# Altium schematic sheet Choin_cpu1_0.SchDoc
size A4; LotOfPieces: 1
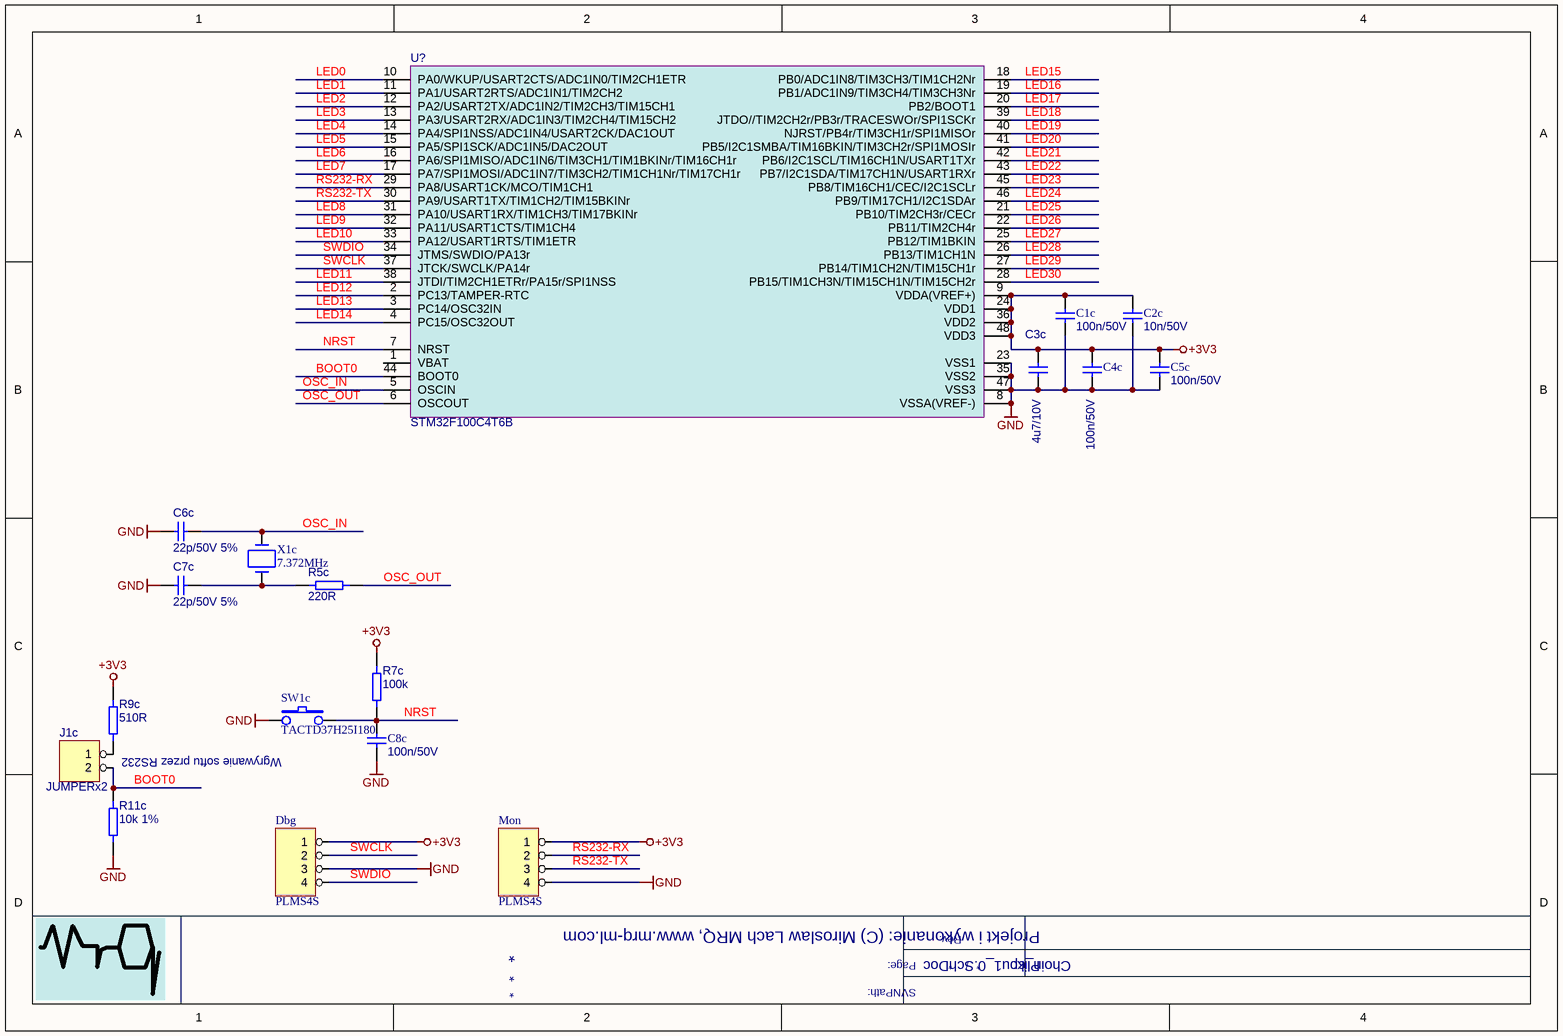
[diagram p0: Choin_cpu1_0.SchDoc]

## Parts
C1c  OtherParams: 100n/50V  [0805]  (hidden comment: CL21B104KBCNNNC)
C2c  OtherParams: 10n/50V  [0805]  (hidden comment: CL21B103KBANNNC)
C3c  OtherParams: 4u7/10V  [1206-IPC]  (hidden comment: CL31B475KPHNNNE)
C4c  OtherParams: 100n/50V  [0805]  (hidden comment: CL21B104KBCNNNC)
C5c  OtherParams: 100n/50V  [0805]  (hidden comment: CL21B104KBCNNNC)
C6c  OtherParams: 22p/50V 5%  [0805]  (hidden comment: CL21C220JBANNNC)
C7c  OtherParams: 22p/50V 5%  [0805]  (hidden comment: CL21C220JBANNNC)
C8c  OtherParams: 100n/50V  [0805]  (hidden comment: CL21B104KBCNNNC)
Dbg  PLMS4S  [PLMS4S]
J1c  JUMPERx2  [2SIP100]
Mon  PLMS4S  [PLMS4S]
R5c  OtherParams: 220R  [0805]  (hidden comment: 0805WAJ 220R T5E)
R7c  OtherParams: 100k  [0805]  (hidden comment: 0805WAJ 100K T5E)
R9c  OtherParams: 510R  [0805]  (hidden comment: 0805WAJ 510R T5E)
R11c  OtherParams: 10k 1%  [0805]  (hidden comment: 0805WAF10KT5E)
SW1c  TACTD37H25I180  [TACTD37H25I180]
U?  STM32F100C4T6B  [MS-026ABC]
X1c  7.372MHz  [HC49/4HSMX]

## Nets
+3V3: C1c.1 C2c.1 C3c.1 C4c.1 C5c.1 Dbg.1 Mon.1 R7c.1 R9c.1 U?.9(VDDA(VREF+)) U?.24(VDD1) U?.36(VDD2) U?.48(VDD3)
GND: C1c.2 C2c.2 C3c.2 C4c.2 C5c.2 C6c.1 C7c.1 C8c.2 Dbg.3 Mon.4 R11c.1 SW1c.1 U?.8(VSSA(VREF-)) U?.23(VSS1) U?.35(VSS2) U?.47(VSS3)
BOOT0: J1c.2 R11c.2 U?.44(BOOT0)
LED0: U?.10(PA0/WKUP/USART2CTS/ADC1IN0/TIM2CH1ETR)
LED1: U?.11(PA1/USART2RTS/ADC1IN1/TIM2CH2)
LED2: U?.12(PA2/USART2TX/ADC1IN2/TIM2CH3/TIM15CH1)
LED3: U?.13(PA3/USART2RX/ADC1IN3/TIM2CH4/TIM15CH2)
LED4: U?.14(PA4/SPI1NSS/ADC1IN4/USART2CK/DAC1OUT)
LED5: U?.15(PA5/SPI1SCK/ADC1IN5/DAC2OUT)
LED6: U?.16(PA6/SPI1MISO/ADC1IN6/TIM3CH1/TIM1BKINr/TIM16CH1r)
LED7: U?.17(PA7/SPI1MOSI/ADC1IN7/TIM3CH2/TIM1CH1Nr/TIM17CH1r)
LED8: U?.31(PA10/USART1RX/TIM1CH3/TIM17BKINr)
LED9: U?.32(PA11/USART1CTS/TIM1CH4)
LED10: U?.33(PA12/USART1RTS/TIM1ETR)
LED11: U?.38(JTDI/TIM2CH1ETRr/PA15r/SPI1NSS)
LED12: U?.2(PC13/TAMPER-RTC)
LED13: U?.3(PC14/OSC32IN)
LED14: U?.4(PC15/OSC32OUT)
LED15: U?.18(PB0/ADC1IN8/TIM3CH3/TIM1CH2Nr)
LED16: U?.19(PB1/ADC1IN9/TIM3CH4/TIM3CH3Nr)
LED17: U?.20(PB2/BOOT1)
LED18: U?.39(JTDO//TIM2CH2r/PB3r/TRACESWOr/SPI1SCKr)
LED19: U?.40(NJRST/PB4r/TIM3CH1r/SPI1MISOr)
LED20: U?.41(PB5/I2C1SMBA/TIM16BKIN/TIM3CH2r/SPI1MOSIr)
LED21: U?.42(PB6/I2C1SCL/TIM16CH1N/USART1TXr)
LED22: U?.43(PB7/I2C1SDA/TIM17CH1N/USART1RXr)
LED23: U?.45(PB8/TIM16CH1/CEC/I2C1SCLr)
LED24: U?.46(PB9/TIM17CH1/I2C1SDAr)
LED25: U?.21(PB10/TIM2CH3r/CECr)
LED26: U?.22(PB11/TIM2CH4r)
LED27: U?.25(PB12/TIM1BKIN)
LED28: U?.26(PB13/TIM1CH1N)
LED29: U?.27(PB14/TIM1CH2N/TIM15CH1r)
LED30: U?.28(PB15/TIM1CH3N/TIM15CH1N/TIM15CH2r)
NRST: C8c.1 R7c.2 SW1c.2 U?.7(NRST)
OSC_IN: C6c.2 U?.5(OSCIN) X1c.1
OSC_OUT: R5c.2 U?.6(OSCOUT)
RS232-RX: Mon.2 U?.29(PA8/USART1CK/MCO/TIM1CH1)
RS232-TX: Mon.3 U?.30(PA9/USART1TX/TIM1CH2/TIM15BKINr)
SWCLK: Dbg.2 U?.37(JTCK/SWCLK/PA14r)
SWDIO: Dbg.4 U?.34(JTMS/SWDIO/PA13r)
NetC7c_2: C7c.2 R5c.1 X1c.2
NetJ1c_1: J1c.1 R9c.2

Not connected (* = marked no-connect by the designer): U? 1(VBAT)

## Notes on the sheet
- Wgrywanie softu przez RS232
- Projekt i wykonanie: (C) Miroslaw Lach MRQ, www.mrq-ml.com
- SVNPath:
- Page:
- Rev.
- /
- Plik:

## Library data of the parts
C1c = CL21B104KBCNNNC[[/\]]0805[[/\]]50V[[/\]]10%[[/\]]100n/50V: MaxVoltage: 50V; Tolerance: 10%; Descript: capacitor 100nF/50V, 0805, X7R, 10%; Currency5: PLN; Amount5: 100+; Value: CL21B104KBCNNNC; Price1: 0,019; Dimensions: 0805; ComponentLink1Description: Datasheet; ComponentLink1URL: http://www.mrq-ml.com/Parts/Capacitors/mlcc_samsung.pdf; Supplier5: tme.pl; Reference5: CL21B104KBCNNNC; Manufacturer5: Samsung; Typ5: CL21B104KBCNNNC; Price5: 0,025; DateOfPrice5: 2013-01-03
C2c = CL21B103KBANNNC[[/\]]0805[[/\]]50V[[/\]]10%[[/\]]10n/50V: Manufacturer1: Samsung; MaxVoltage: 50V; Tolerance: 10%; Tmin: -55; Tmax: +125; Descript: capacitor 10nF/50V, 0805, X7R, 10%; Currency1: PLZ; Amount1: 12000+; Currency5: PLN; Amount5: 100+; Value: CL21B103KBANNNC; Supplier1: tme.pl; Reference1: CL21B103KBANNNC; Price1: 0,013; Typ1: CL21B103KBANNNC; Dimensions: 0805; ComponentLink1Description: Datasheet; ComponentLink1URL: http://www.mrq-ml.com/Parts/Capacitors/mlcc_samsung.pdf; DateOfPrice1: 2010-01-31; Supplier5: tme.pl; Reference5: CL21B103KBANNNC; Manufacturer5: Samsung; Typ5: CL21B103KBANNNC; Price5: 0,029; DateOfPrice5: 2012-09-19
C3c = CL31B475KPHNNNE[[/\]]1206[[/\]]10V[[/\]]10%[[/\]]4u7/10V: Manufacturer1: Samsung; MaxVoltage: 10V; Tolerance: 10%; Tmin: -55; Tmax: +125; Descript: capacitor 4.7uF, 10V, X7R, 10%, 1206; Currency1: PLN; Amount1: 12000+; Amount5: 100+; Value: CL31B475KPHNNNE; Supplier1: tme.pl; Reference1: CL31B475KPHNNNE; Typ1: CL31B475KPHNNNE; Dimensions: 1206; ComponentLink1Description: Datasheet; ComponentLink1URL: http://www.mrq-ml.com/Parts/Capacitors/mlcc_samsung.pdf; DateOfPrice1: 2010-09-07; Supplier5: tme.pl; Reference5: CL31B475KPHNNNE; Manufacturer5: Samsung; Typ5: CL31B475KPHNNNE; Price5: 0,179; Currency5: PLN; DateOfPrice5: 2012-11-24; Price1: 0,179
C4c C5c C8c = CL21B104KBCNNNC[[/\]]0805[[/\]]50V[[/\]]10%[[/\]]100n/50V: Manufacturer1: Samsung; MaxVoltage: 50V; Tolerance: 10%; Tmin: -55; Tmax: +125; Descript: capacitor 100nF/50V, 0805, X7R, 10%; Currency1: PLZ; Amount1: 12000+; Currency5: PLN; Amount5: 100+; Value: CL21B104KBCNNNC; Supplier1: tme.pl; Reference1: CL21B104KBCNNNC; Price1: 0,012; Typ1: CL21B104KBCNNNC; Dimensions: 0805; ComponentLink1Description: Datasheet; ComponentLink1URL: http://www.mrq-ml.com/Parts/Capacitors/mlcc_samsung.pdf; DateOfPrice1: 2010-05-06; Supplier5: tme.pl; Reference5: CL21B104KBCNNNC; Manufacturer5: Samsung; Typ5: CL21B104KBCNNNC; Price5: 0,025; DateOfPrice5: 2012-09-19
C6c C7c = CL21C220JBANNNC[[/\]]0805[[/\]]50V[[/\]]5%[[/\]]22p/50V 5%: Manufacturer1: Samsung; Amount2: 4000+; MaxVoltage: 50V; Tolerance: 5%; Tmin: -55; Tmax: +125; Descript: capacitor 22pF, 50V, COG 5%; Currency1: PLZ; Amount1: 12000+; Currency5: PLN; Amount5: 100+; Value: CL21C220JBANNNC; Supplier1: tme.pl; Reference1: CL21C220JBANNNC; Price1: 0,018; Price2: 0,012; Reference2: CL21C220JBANNNC; Supplier2: tme.pl; Typ1: CL21C220JBANNNC; Manufacturer2: Samsung; Dimensions: 0805; ComponentLink1Description: Datasheet; ComponentLink1URL: http://www.mrq-ml.com/Parts/Capacitors/mlcc_samsung.pdf; DateOfPrice1: 2010-04-07; Typ2: CL21C220JBANNNC; Currency2: PLZ; DateOfPrice2: 2009-08-16; Supplier5: tme.pl; Reference5: CL21C220JBANNNC; Manufacturer5: Samsung; Typ5: CL21C220JBANNNC; Price5: 0,029; DateOfPrice5: 2012-09-19
Dbg Mon = PLMS4S[[/\]]4x2mm: Descript: connector 2.00mm pitch, 4 poles, one row; Reference5: PLMS40S-LF; Currency5: PLN; Amount5: 1+; Value: PLMS4S; Dimensions: 4x2mm; ComponentLink1Description: Datasheet; ComponentLink1URL: http://www.mrq-ml.com/Parts/Connectors/plms40s-lf.pdf; Supplier5: maritex.com.pl; Price5: 0,085; DateOfPrice5: 2012-11-24; Price1: 0,0850
J1c = JUMPERx2[[/\]]2.54mm: Descript: pin header 2 pin, 1/40 of PLD80S; Reference1: PLD80S-2; Currency1: PLN; Amount1: 80000+; Currency2: PLZ; Amount2: 40000+; Amount3: 9600+; Amount4: 1600+; Amount5: 20+; Value: JUMPERx2; Dimensions: 2.54mm; Supplier1: maritex.com.pl; DateOfPrice1: 2010-03-13; Supplier2: maritex.com.pl; Reference2: PLD80S-2; Price2: 0,01425; DateOfPrice2: 2009-11-24; Supplier3: maritex.com.pl; Reference3: PLD80S-2; Price3: 0,015; Currency3: PLZ; DateOfPrice3: 2009-11-24; Supplier4: maritex.com.pl; Reference4: PLD80S-2; Price4: 0,01575; Currency4: PLZ; DateOfPrice4: 2009-11-24; Supplier5: maritex.com.pl; Reference5: PLD80S-2; Price5: 0,0645; Currency5: PLN; DateOfPrice5: 2012-11-24; Price1: 0,0645
R5c = 0805WAJ 220R T5E[[/\]]0805[[/\]]0.125W[[/\]]5%[[/\]]220R: Manufacturer1: Royal Ohm; Reference1: SMD0805 220R; Amount1: 50000+; Amount2: 15000+; DissPower: 0.125W; Tolerance: 5%; Tmin: -55; Tmax: +155; Descript: Resistor 220 ohm, 0805, 5%; Currency1: PLN; Currency2: PLZ; Amount4: 1000+; Amount5: 100+; Value: 0805WAJ 220R T5E; Supplier1: tme.pl; Price2: 0,004; Reference2: SMD0805 220R; Supplier2: tme.pl; Typ1: 0805WAJ 220R T5E; Manufacturer2: Royal Ohm; Typ2: 0805WAJ 220R T5E; Dimensions: 0805; ComponentLink1Description: Datasheet; ComponentLink1URL: http://www.mrq-ml.com/Parts/Resistors/RoyalOhm_rezystor-smd.pdf; DateOfPrice1: 2009-10-06; DateOfPrice2: 2009-10-06; Supplier4: tme.pl; Reference4: SMD0805 220R; Manufacturer4: Royal Ohm; Typ4: 0805WAJ 220R T5E; Price4: 0,013; Currency4: PLZ; DateOfPrice4: 2009-10-06; Supplier5: tme.pl; Reference5: SMD0805 220R; Manufacturer5: Royal Ohm; Typ5: 0805WAJ 220R T5E; Price5: 0,025; Currency5: PLN; DateOfPrice5: 2012-09-18
R7c = 0805WAJ 100K T5E[[/\]]0805[[/\]]0.125W[[/\]]5%[[/\]]100k: Manufacturer1: Royal Ohm; Descript: Resistor 100kohm, 0805, 5%; Reference1: SMD0805 100K; Amount1: 50000+; Amount2: 15000+; DissPower: 0.125W; Tolerance: 5%; Tmin: -55; Tmax: +155; Currency1: PLN; Currency2: PLZ; Reference5: SMD0805-100K; Amount5: 100+; Value: 0805WAJ 100K T5E; Supplier1: tme.pl; Price2: 0,004; Reference2: SMD0805 100K; Supplier2: tme.pl; Typ1: 0805WAJ 100k T5E; Manufacturer2: Royal Ohm; Typ2: 0805WAJ 100k T5E; Dimensions: 0805; ComponentLink1Description: Datasheet; ComponentLink1URL: http://www.mrq-ml.com/Parts/Resistors/RoyalOhm_rezystor-smd.pdf; DateOfPrice1: 2010-05-06; DateOfPrice2: 2009-10-04; Supplier5: tme.pl; Manufacturer5: Royal Ohm; Typ5: 0805WAJ 100k T5E; Price5: 0,025; Currency5: PLN; DateOfPrice5: 2012-11-24; Price1: 0,025
R9c = 0805WAJ 510R T5E[[/\]]0805[[/\]]0.125W[[/\]]5%[[/\]]510R: Manufacturer1: Royal Ohm; Reference1: SMD0805 510R; Amount1: 50000+; Amount2: 15000+; DissPower: 0.125W; Tolerance: 5%; Tmin: -55; Tmax: +155; Descript: Resistor 510 ohm, 0805, 5%; Currency1: PLN; Currency2: PLZ; Amount4: 1000+; Reference5: SMD0805-510R; Amount5: 100+; Value: 0805WAJ 510R T5E; Supplier1: tme.pl; Price2: 0,004; Reference2: SMD0805 510R; Supplier2: tme.pl; Typ1: 0805WAJ 510R T5E; Manufacturer2: Royal Ohm; Typ2: 0805WAJ 510R T5E; Dimensions: 0805; ComponentLink1Description: Datasheet; ComponentLink1URL: http://www.mrq-ml.com/Parts/Resistors/RoyalOhm_rezystor-smd.pdf; DateOfPrice1: 2010-02-03; DateOfPrice2: 2009-10-06; Supplier4: tme.pl; Reference4: SMD0805 510R; Manufacturer4: Royal Ohm; Typ4: 0805WAJ 510R T5E; Price4: 0,013; Currency4: PLZ; DateOfPrice4: 2009-10-06; Supplier5: tme.pl; Manufacturer5: Royal Ohm; Typ5: 0805WAJ 510R T5E; Price5: 0,025; Currency5: PLN; DateOfPrice5: 2012-11-24; Price1: 0,025
R11c = 0805WAF10KT5E[[/\]]0805[[/\]]0.125W[[/\]]1%[[/\]]10k 1%: Manufacturer1: Royal Ohm; Reference1: SMD0805 10K 1%; Amount1: 50000+; Amount2: 15000+; DissPower: 0.125W; Tolerance: 1%; Tmin: -55; Tmax: +155; Descript: Resistor 10kohm, 0805, 1%; Currency1: PLN; Currency2: PLZ; Amount4: 1000+; Reference5: SMD0805-10K-1%; Amount5: 100+; Value: 0805WAF10KT5E; Supplier1: tme.pl; Price2: 0,007; Reference2: SMD0805 10K 1%; Supplier2: tme.pl; Typ1: 0805WAF 10K T5E; Manufacturer2: Royal Ohm; Typ2: 0805WAF 10K T5E; Dimensions: 0805; ComponentLink1Description: Datasheet; ComponentLink1URL: http://www.mrq-ml.com/Parts/Resistors/RoyalOhm_rezystor-smd.pdf; DateOfPrice1: 2010-02-01; DateOfPrice2: 2009-10-20; Supplier4: tme.pl; Reference4: SMD0805 10K 1%; Manufacturer4: Royal Ohm; Typ4: 0805WAF 10K T5E; Price4: 0,019; Currency4: PLZ; DateOfPrice4: 2009-10-20; Supplier5: tme.pl; Manufacturer5: Royal Ohm; Typ5: 0805WAF 10K T5E; Price5: 0,029; Currency5: PLN; DateOfPrice5: 2012-07-17; Price1: 0,018
SW1c = TACTD37H25I180[[/\]]TACTD37H25I180[[/\]]3.7x6.1x2.5: Descript: TACT switch 3.7x6.1x2.5, SMD, dustproof; Currency5: PLN; Amount5: 1+; Value: TACTD37H25I180; Dimensions: 3.7x6.1x2.5; ComponentLink1Description: Datasheet; ComponentLink1URL: http://www.mrq-ml.com/Parts/Electromechanical/TACTD37H25I.pdf; Supplier5: maritex.com.pl; Reference5: TACTD37H25I180; Manufacturer5: www.innocentswitch.co.kr; Price5: 0,54; DateOfPrice5: 2012-11-24; OtherParams: TACTD37H25I180; Price1: 0,49
U? = STM32F100C4T6B[[/\]]MS-026ABC: Descript: MCU, 32BIT, CORTEXM3, 16K FLASH, 48LQFP; Currency5: PLN; Amount5: 1+; Value: STM32F100C4T6B; Price1: 6,58; Dimensions: MS-026ABC; ComponentLink1Description: Datasheet; ComponentLink1URL: http://www.mrq-ml.com/Parts/ICs/STM32F103xC_D_E.pdf; Supplier5: kamami.pl; Reference5: STM32F100C4T6B; Manufacturer5: ST; Typ5: STM32F100C4T6B; Price5: 7,52; DateOfPrice5: 2012-10-15
X1c = 7.372MHz[[/\]]HC49/4HSMX[[/\]]7.372MHz: Descript: crystal 7.372MHz SMD HC49; Reference5: 7.372M SMDHC49S; Currency5: PLZ; Amount5: 1+; Value: 7.372MHz; OtherParams: 7.372MHz; Dimensions: HC49/4HSMX; Supplier5: tme.pl; Price5: 2,59; DateOfPrice5: 2011-04-26